# EAGLE design BBQ_Blower (EAGLE 9.4.2)
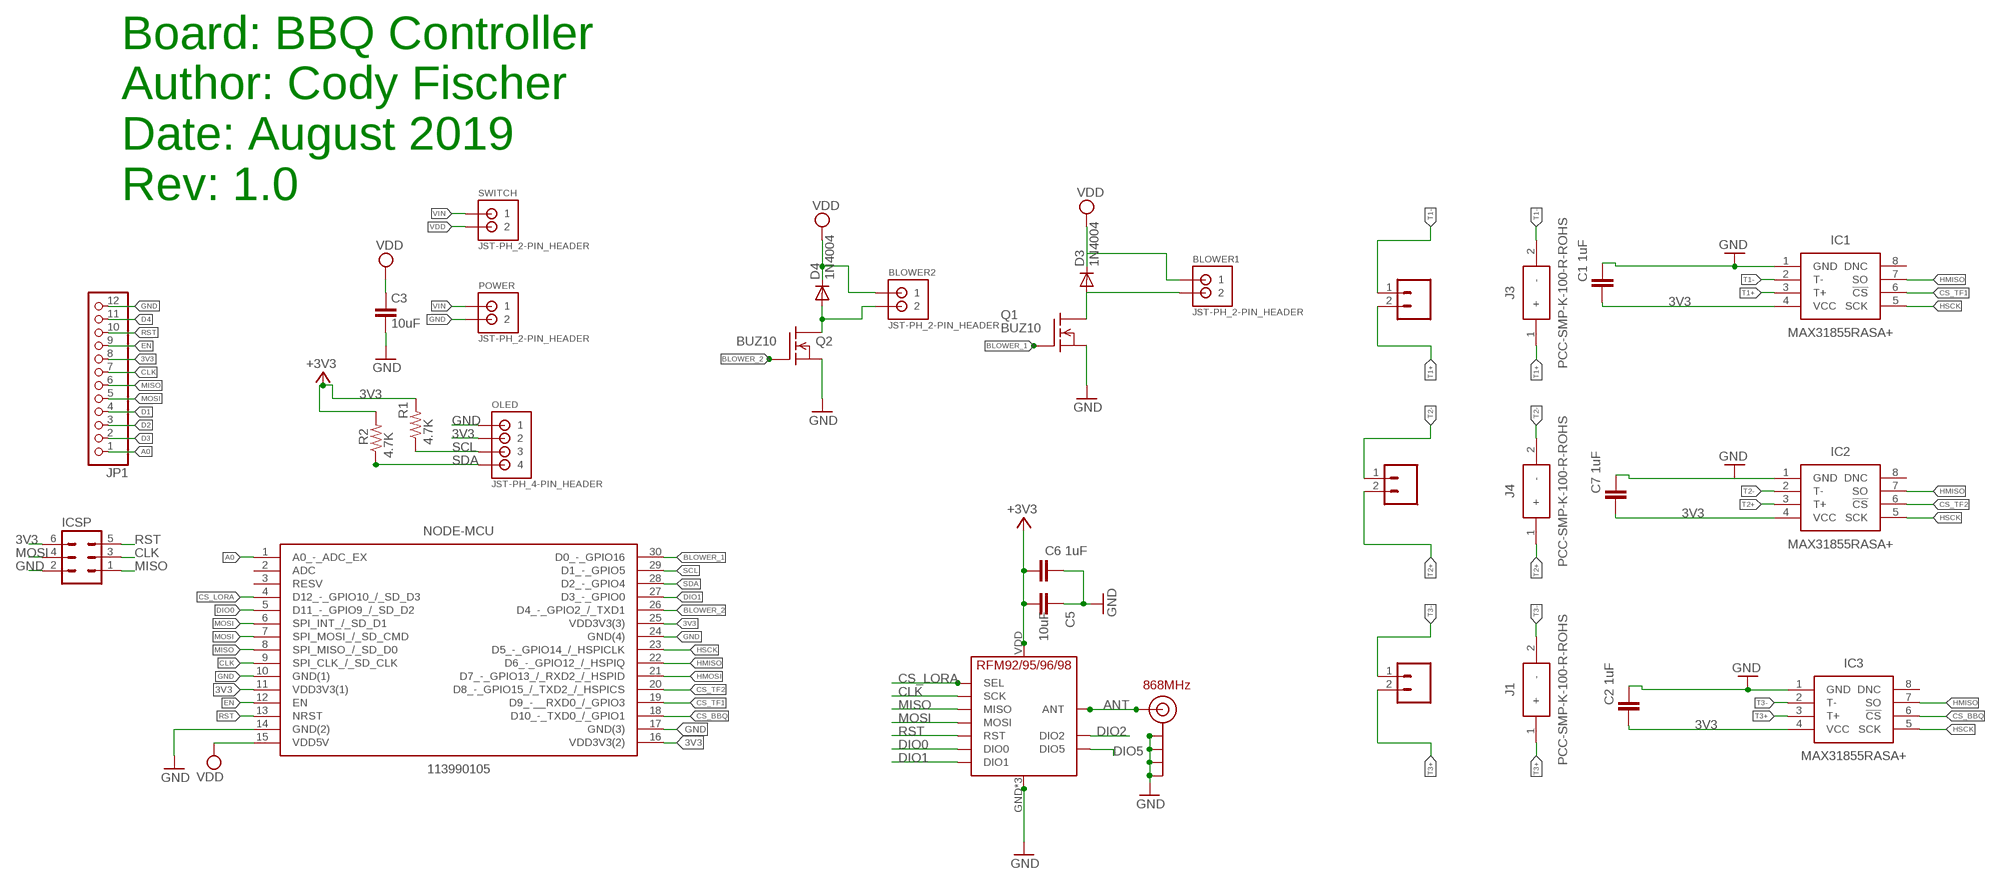
[diagram p0: schematic, sheet 1]

## Parts
BLOWER1  JST-PH_2-PIN_HEADER  [JST_B2B-PH_HEADER]
BLOWER2  JST-PH_2-PIN_HEADER  [JST_B2B-PH_HEADER]
C1  1uF  C-EUC0805K  [C0805K]
C2  1uF  C-EUC0805K  [C0805K]
C3  10uF  C-EU025-050X050  [C025-050X050]
C5  10uF  C-EUC0805K  [C0805K]
C6  1uF  C-EUC0805K  [C0805K]
C7  1uF  C-EUC0805K  [C0805K]
D3  1N4004  [DO41-10]
D4  1N4004  [DO41-10]
IC1  MAX31855RASA+  [SOIC127P600X175-8N]
IC2  MAX31855RASA+  [SOIC127P600X175-8N]
IC3  MAX31855RASA+  [SOIC127P600X175-8N]
ICSP  MA03-2  [MA03-2]
J1  PCC-SMP-K-100-R-ROHS  [PCC-SMP]
J3  PCC-SMP-K-100-R-ROHS  [PCC-SMP]
J4  PCC-SMP-K-100-R-ROHS  [PCC-SMP]
J$2  ANTENNATINY  [SMA_UFL_PAD_TINY]
JP1  PINHD-1X12  [1X12]
NODE-MCU  113990105  [DIP2286W64P254L4826H735Q30N]
OLED  JST-PH_4-PIN_HEADER  [JST_B4B-PH_HEADER]
POWER  JST-PH_2-PIN_HEADER  [JST_B2B-PH_HEADER]
Q1  BUZ10  [TO220]
Q2  BUZ10  [TO220]
R1  4.7K  RESISTOR0805-RES  [0805-RES]
R2  4.7K  RESISTOR0805-RES  [0805-RES]
SWITCH  JST-PH_2-PIN_HEADER  [JST_B2B-PH_HEADER]
TH1  CONN_025MM  [SCREWTERMINAL-5MM-2]
TH2  CONN_025MM  [SCREWTERMINAL-5MM-2]
TH3  CONN_025MM  [SCREWTERMINAL-5MM-2]
U$5  RFM95  [RFM95]

## Nets
3V3: C1.2 C2.2 C5.2 C6.2 C7.2 IC1.4(VCC) IC2.4(VCC) IC3.4(VCC) ICSP.6 JP1.8 NODE-MCU.11(VDD3V3(1)) NODE-MCU.16(VDD3V3(2)) NODE-MCU.25(VDD3V3(3)) OLED.P2 R1.2 R2.2 U$5.VDD(VCC) ; supply symbol labelled +3V3
A0: JP1.1 NODE-MCU.1(A0_-_ADC_EX)
ANT: J$2.ANT1(SIGNAL) J$2.ANT2(SIGNAL) J$2.ANT3(SIGNAL) U$5.ANT
BLOWER1: BLOWER2.P2 D4.A Q2.2(D)
BLOWER2: BLOWER1.P2 D3.A Q1.2(D)
BLOWER_1: NODE-MCU.30(D0_-_GPIO16) Q1.1(G)
BLOWER_2: NODE-MCU.26(D4_-_GPIO2_/_TXD1) Q2.1(G)
CLK: ICSP.3 JP1.7 NODE-MCU.9(SPI_CLK_/_SD_CLK) U$5.SCK
CS_BBQ: IC3.6(!CS) NODE-MCU.18(D10_-_TXD0_/_GPIO1)
CS_LORA: NODE-MCU.4(D12_-_GPIO10_/_SD_D3) U$5.NSS(SEL)
CS_TF1: IC1.6(!CS) NODE-MCU.19(D9_-__RXD0_/_GPIO3)
CS_TF2: IC2.6(!CS) NODE-MCU.20(D8_-_GPIO15_/_TXD2_/_HSPICS)
D1: JP1.4
D2: JP1.3
D3: JP1.2
D4: JP1.11
DIO0: NODE-MCU.5(D11_-_GPIO9_/_SD_D2) U$5.DIO0
DIO1: NODE-MCU.27(D3_-_GPIO0) U$5.DIO1
DIO2: U$5.DIO2
DIO5: U$5.DIO5
EN: JP1.9 NODE-MCU.12(EN)
GND: C1.1 C2.1 C3.2 C5.1 C6.1 C7.1 IC1.1(GND) IC2.1(GND) IC3.1(GND) ICSP.2 J$2.GND1(GND) J$2.GND2(GND) J$2.GND3(GND) J$2.GND4(GND) JP1.12 NODE-MCU.10(GND(1)) NODE-MCU.14(GND(2)) NODE-MCU.17(GND(3)) NODE-MCU.24(GND(4)) OLED.P1 POWER.P2 Q1.3(S) Q2.3(S) U$5.GND U$5.GND1(GND) U$5.GND2(GND)
HMISO: IC1.7(SO) IC2.7(SO) IC3.7(SO) NODE-MCU.22(D6_-_GPIO12_/_HSPIQ)
HMOSI: NODE-MCU.21(D7_-_GPIO13_/_RXD2_/_HSPID)
HSCK: IC1.5(SCK) IC2.5(SCK) IC3.5(SCK) NODE-MCU.23(D5_-_GPIO14_/_HSPICLK)
MISO: ICSP.1 JP1.6 NODE-MCU.8(SPI_MISO_/_SD_D0) U$5.MISO
MOSI: ICSP.4 JP1.5 NODE-MCU.6(SPI_INT_/_SD_D1) NODE-MCU.7(SPI_MOSI_/_SD_CMD) U$5.MOSI
RST: ICSP.5 JP1.10 NODE-MCU.13(NRST) U$5.RST
SCL: NODE-MCU.29(D1_-_GPIO5) OLED.P3 R1.1
SDA: NODE-MCU.28(D2_-_GPIO4) OLED.P4 R2.1
T1+: IC1.3(T+) J3.1(+) TH3.2
T1-: IC1.2(T-) J3.2(-) TH3.1
T2+: IC2.3(T+) J4.1(+) TH2.2
T2-: IC2.2(T-) J4.2(-) TH2.1
T3+: IC3.3(T+) J1.1(+) TH1.2
T3-: IC3.2(T-) J1.2(-) TH1.1
VDD: BLOWER1.P1 BLOWER2.P1 C3.1 D3.C D4.C NODE-MCU.15(VDD5V) SWITCH.P2
VIN: POWER.P1 SWITCH.P1
Unconnected: IC1.8(DNC) IC2.8(DNC) IC3.8(DNC) NODE-MCU.2(ADC) NODE-MCU.3(RESV)

## Notes on the sheet
- Board: BBQ Controller
  Author: Cody Fischer
  Date: August 2019
  Rev: 1.0
- 868MHz

## Library data of the parts
BLOWER1 BLOWER2 POWER SWITCH = SRG:JST-PH_2-PIN_HEADER: 2-pin JST PH Shrouded Header, top entry P/N B2B-PH-K-S Mating connector PHR-2 Mating cable assembly: Sparkfun PRT-09914 <http://www.sparkfun.com/products/9914>
C1-C3 C5-C7 = resistor:C-EU: CAPACITOR, European symbol
D3 D4 = adafruit:1N4004: DIODE General purpose 1N400x type rectifier (With bigger pads) http://www.ladyada.net/library/pcb/eaglelibrary.html
IC1-IC3 = MAX31855RASA+:MAX31855RASA+: Thermocouple-to-Digital, type R SOIC8 Maxim MAX31855RASA+, Thermocouple Amplifier, 3.3 V, 8-Pin SOIC <https://componentsearchengine.com/Images/3/MAX31855RASA%2B.jpg> Source: Datasheet <https://datasheets.maximintegrated.com/en/ds/MAX31855.pdf>; DESCRIPTION: Thermocouple-to-Digital, type R SOIC8 Maxim MAX31855RASA+, Thermocouple Amplifier, 3.3 V, 8-Pin SOIC; HEIGHT: 1.75mm; MANUFACTURER_NAME: Maxim Integrated; MANUFACTURER_PART_NUMBER: MAX31855RASA+; RS_PART_NUMBER: 7833891P; SUPPLIER_NAME: RS
ICSP = con-lstb:MA03-2: PIN HEADER; OC_FARNELL: unknown; OC_NEWARK: unknown
J1 J3 J4 = PCC-SMP-K-100-R-ROHS:PCC-SMP-K-100-R-ROHS: NEWPORT ELECTRONICS - PCC-SMP-K-100-R-ROHS - CIRCUIT BOARD THERMOCOUPLE, K TYPE Source: Datasheet <http://www.farnell.com/datasheets/1789660.pdf>; DESCRIPTION: NEWPORT ELECTRONICS - PCC-SMP-K-100-R-ROHS - CIRCUIT BOARD THERMOCOUPLE, K TYPE; HEIGHT: mm; MANUFACTURER_NAME: NEWPORT ELECTRONICS; MANUFACTURER_PART_NUMBER: PCC-SMP-K-100-R-ROHS; SUPPLIER_NAME: RS
J$2 = _c2h:ANTENNA: SMA Antenna Connector End launch SMA connector. The paste layer has been removed so that the connector can be hand soldered onto the board after reflow.
JP1 = adafruit:PINHD-1X12: PIN HEADER
NODE-MCU = 113990105:113990105: NodeMCU DEVKIT V1.0 <https://componentsearchengine.com/Images/1/113990105.jpg> Source: Datasheet <https://github.com/nodemcu/nodemcu-devkit-v1.0/blob/master/NODEMCU_DEVKIT_V1.0.PDF>; DESCRIPTION: NodeMCU DEVKIT V1.0; HEIGHT: 7.35mm; MANUFACTURER_NAME: Seeed Studio; MANUFACTURER_PART_NUMBER: 113990105; SUPPLIER_NAME: RS
OLED = SRG:JST-PH_4-PIN_HEADER: 4-pin JST PH Shrouded Header, top entry P/N B4B-PH-K-S Mating connector PHR-4 Mating cable assembly: Sparkfun PRT-09916 <http://www.sparkfun.com/products/9916>
Q1 Q2 = transistor-fet:BUZ10: N-Channel Enhancement MOSFET 50V; 20A; 0,080Ohm
R1 R2 = _c2h:RESISTOR: Resistor Basic schematic elements and footprints for 0603, 1206, and PTH resistors.
TH1-TH3 = SparkFun-Connectors:CONN_02: Multi connection point. Often used as Generic Header-pin footprint for 0.1 inch spaced/style header connections On any of the 0.1 inch spaced packages, you can populate with these: Break Away Headers - Straight <https://www.sparkfun.com/products/116> (PRT-00116) Break Away Male Headers - Right Angle <https://www.sparkfun.com/products/553> (PRT-00553) Female Headers <https://www.sparkfun.com/products/115> (PRT-00115) Break Away Headers - Machine Pin <https://www.sparkfun.com/products/117> (PRT-00117) Break Away Female Headers - Swiss Machine Pin <https://www.sparkfun.com/products/743> (PRT-00743) For SCREWTERMINALS and SPRING TERMINALS visit here: Screw Terimnals on SparkFun.com <https://www.sparkfun.com/search/results?term=Screw+Terminals> (5mm/3.5mm/2.54mm spacing) This device is also useful as a general connection point to wire up your design to another part of your project. Our various solder wires solder well into these plated through hole pads. Hook-Up Wire - Assortment (Stranded, 22 AWG) <https://www.sparkfun.com/products/11375> (PRT-11375) Hook-Up Wire - Assortment (Solid Core, 22 AWG) <https://www.sparkfun.com/products/11367> (PRT-11367) View the entire wire category on our website here <https://www.sparkfun.com/categories/141> Special notes: Molex polarized connector foot print use with: PRT-08233 with associated crimp pins and housings. 2.54_SCREWTERM for use with PRT-10571. 3.5mm Screw Terminal footprints for PRT-08084 5mm Screw Terminal footprints for use with PRT-08432; SF_SKU: PRT-08432
U$5 = _c2h:RFM95

## Net classes
0 default: width 0.203 mm, drill 0.356 mm, clearance 0.152 mm
1 POWER: width 1.905 mm, clearance 0.381 mm

## Board
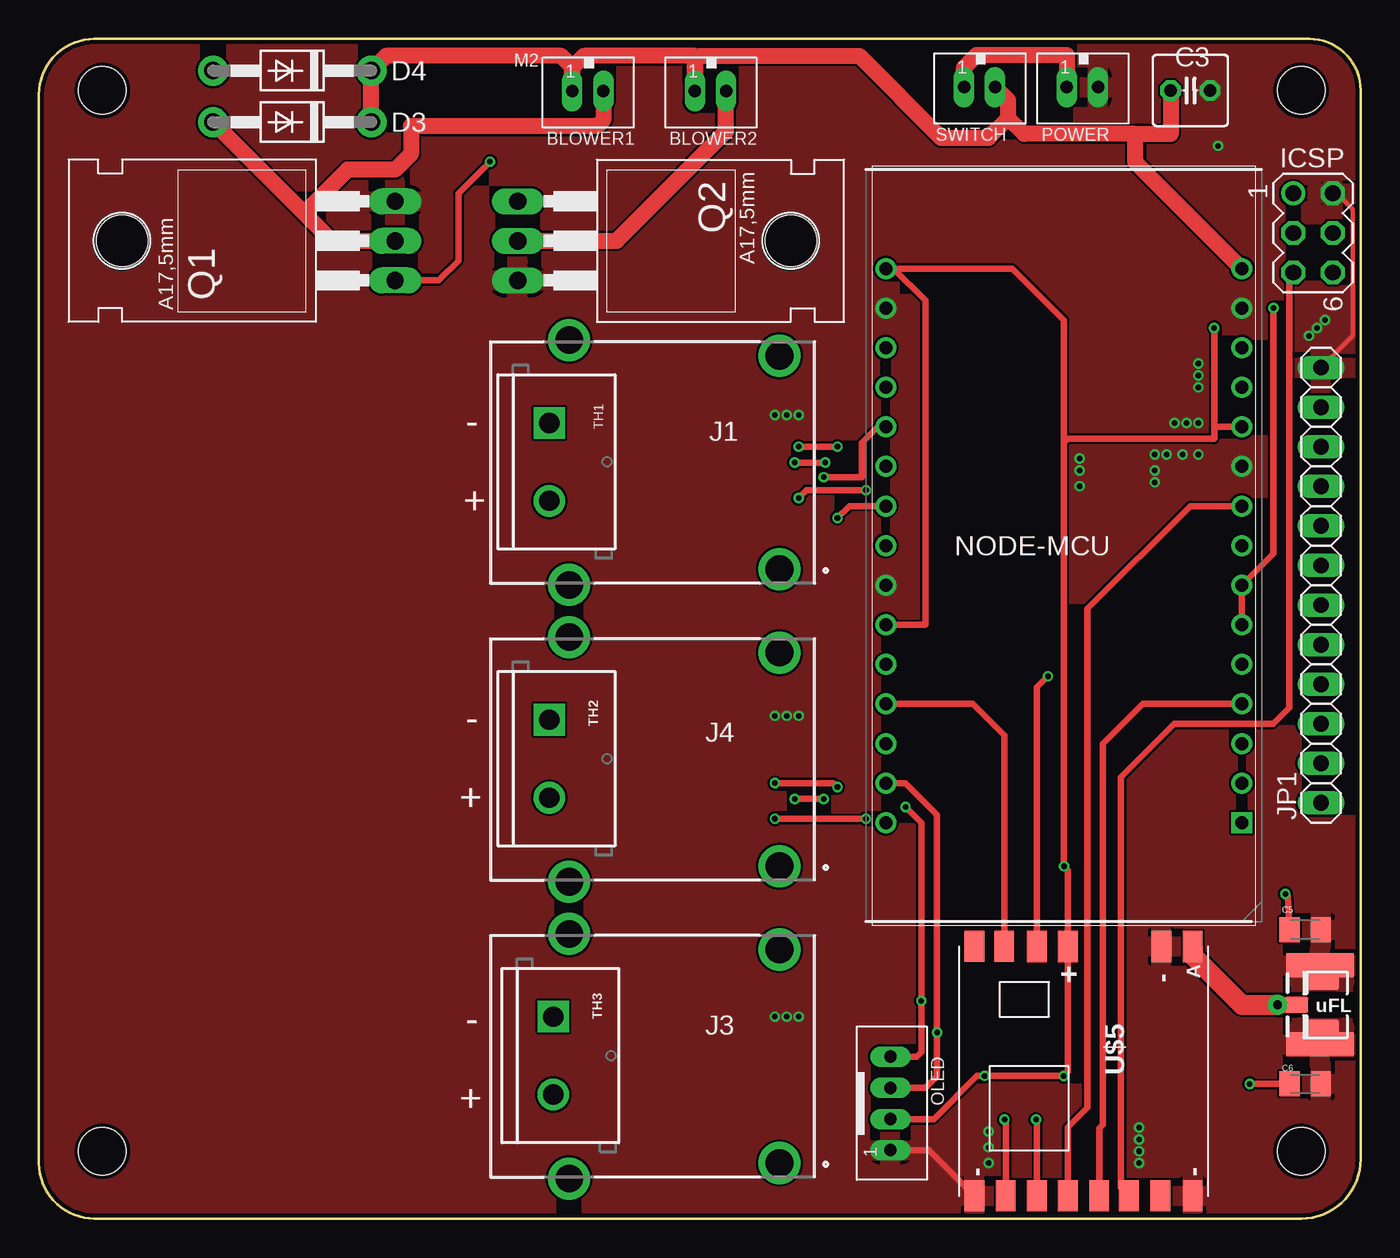
[diagram p1: board, top side]
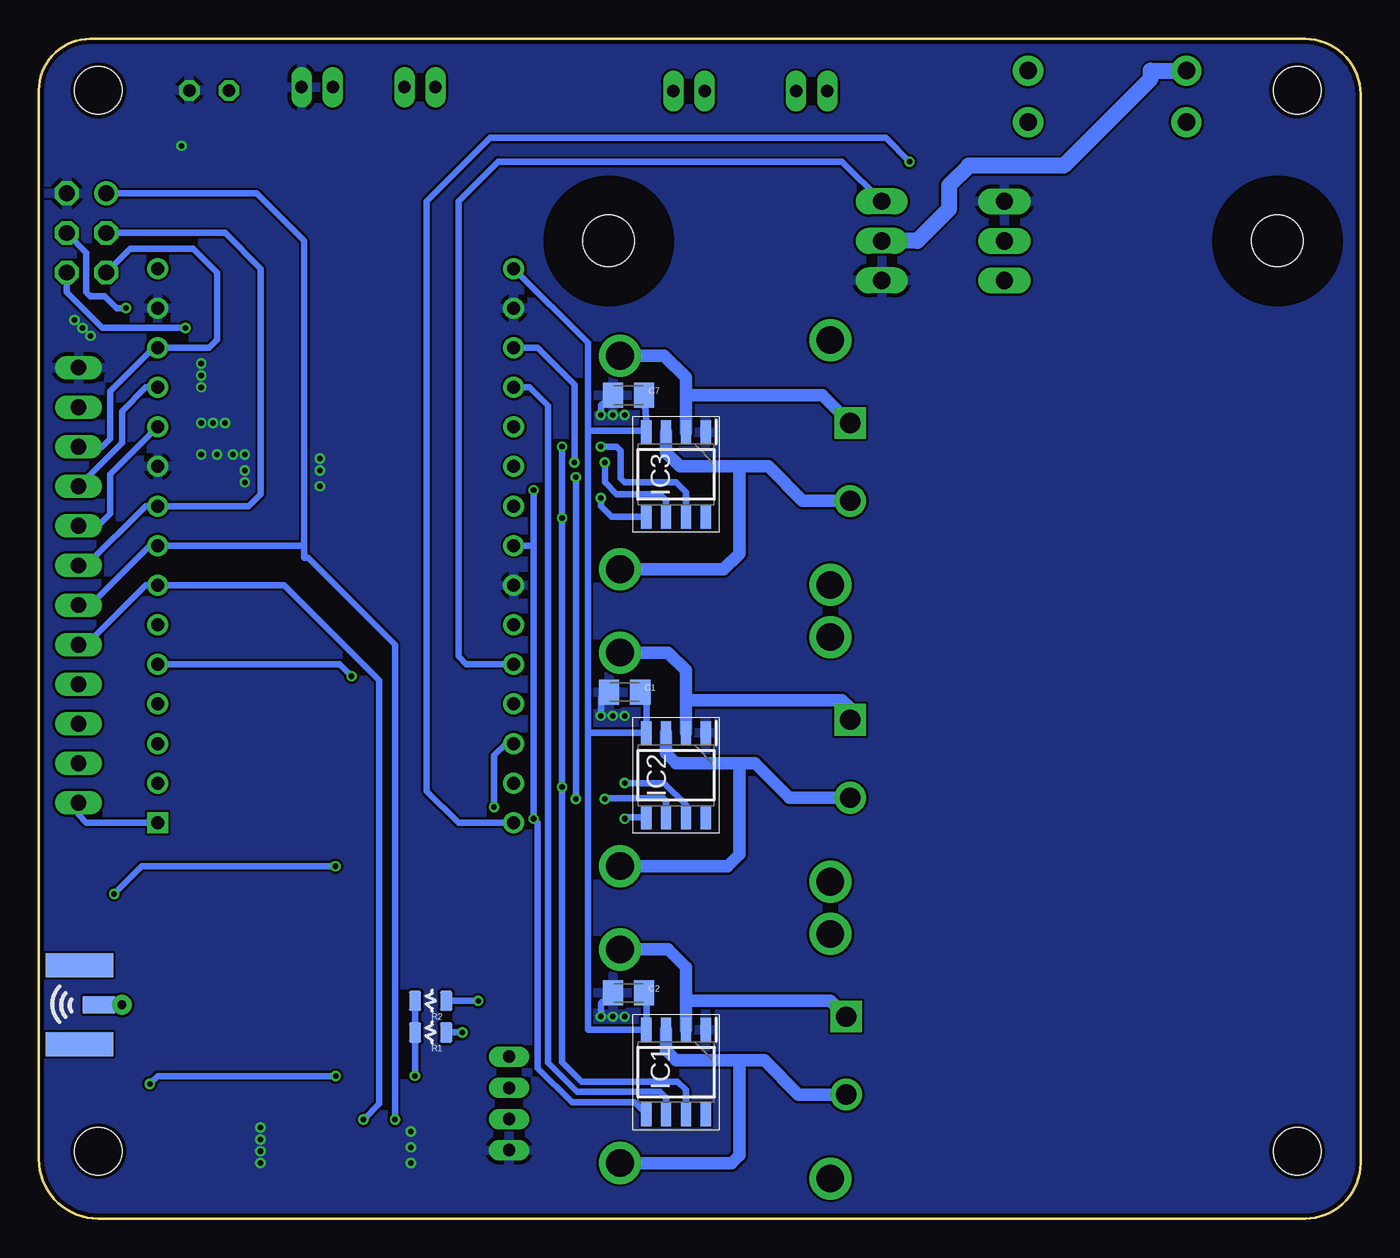
[diagram p2: board, bottom side, seen from below]

Size 84.84 x 75.69 mm. Coordinates in mm from the lower left corner, seen from the top.
Outline: 3.56,0 81.03,0 arc90 84.84,3.81 84.84,72.39 arc90 81.53,75.69 3.56,75.69 arc90 0,72.14 0,3.56 arc90 3.56,0
Copper layers (1*16): Top 0.035mm / dielectric 1.5mm / Bottom 0.035mm
Design rules "seeed-studio-2-layer": minimum track width 6mil, minimum drill 12mil, track to track 6mil, track to pad 6mil, pad to pad 6mil, via to via 6mil, smd to smd 0mil, copper to edge 10mil, drill to drill 10mil, minimum pad ring 10mil, minimum via ring 6mil, stop-mask expansion 2mil, vias tented up to drill 100mil, thermal gap 10mil
Holes 3.05 mm at 4.06,72.39 4.06,4.32 81.03,4.32 81.03,72.39

### Footprints (pad centres in the part's own frame; a part is rotated, then mirrored left to right if it is on the bottom)
JST_B2B-PH_HEADER = drill 0.8 long: P1 1.075,0.048; P2 -0.925,0.048
C0805K = smd 1.3 x 1.6: 1 -1,0; 2 1,0
C025-050X050 = drill 0.813 octagon: 1 -1.27,0; 2 1.27,0
DO41-10 = drill 1.118 pad 1.93: A 5.08,0; C -5.08,0
SOIC127P600X175-8N = smd 1.525 x 0.65: 1 -2.712,1.905; 2 -2.712,0.635; 3 -2.712,-0.635; 4 -2.712,-1.905; 5 2.712,-1.905; 6 2.712,-0.635; 7 2.712,0.635; 8 2.712,1.905
MA03-2 = drill 1.016: 1 -2.54,-1.27 | drill 1.016 octagon: 2 -2.54,1.27; 3 0,-1.27; 4 0,1.27; 5 2.54,-1.27; 6 2.54,1.27
PCC-SMP = drill 1.77 pad 2.7: 1 2.25,6.85; 2 2.25,-6.85; 3 15.75,7.85; 4 15.75,-7.85
SMA_UFL_PAD_TINY = smd 1.524 x 1.016: ANT1 -3.843,0 | drill 0.559 pad 1.27: ANT2 -5.08,0 | smd 2.032 x 1.143 bottom: ANT3 -3.589,0 | smd 2.2 x 1.016: GND1 -2.223,1.47; GND2 -2.223,-1.47 | smd 4.318 x 1.524: GND3 -2.349,-2.54; GND4 -2.349,2.54 | smd 4.318 x 1.524 bottom: GND5 -2.349,2.54; GND6 -2.349,-2.54
1X12 = drill 1.016 long: 1 -13.97,0; 2 -11.43,0; 3 -8.89,0; 4 -6.35,0; 5 -3.81,0; 6 -1.27,0; 7 1.27,0; 8 3.81,0; 9 6.35,0; 10 8.89,0; 11 11.43,0; 12 13.97,0
DIP2286W64P254L4826H735Q30N = drill 0.835 pad 1.235 square: 1 -11.43,17.78 | drill 0.835 pad 1.235: 2 -11.43,15.24; 3 -11.43,12.7; 4 -11.43,10.16; 5 -11.43,7.62; 6 -11.43,5.08; 7 -11.43,2.54; 8 -11.43,0; 9 -11.43,-2.54; 10 -11.43,-5.08; 11 -11.43,-7.62; 12 -11.43,-10.16; 13 -11.43,-12.7; 14 -11.43,-15.24; 15 -11.43,-17.78; 16 11.43,-17.78; 17 11.43,-15.24; 18 11.43,-12.7; 19 11.43,-10.16; 20 11.43,-7.62; 21 11.43,-5.08; 22 11.43,-2.54; 23 11.43,0; 24 11.43,2.54; 25 11.43,5.08; 26 11.43,7.62; 27 11.43,10.16; 28 11.43,12.7; 29 11.43,15.24; 30 11.43,17.78
JST_B4B-PH_HEADER = drill 0.8 long: P1 2.98,0.048; P2 0.98,0.048; P3 -1.02,0.048; P4 -3.02,0.048
TO220 = drill 1.118 long: 1 -2.54,-6.35; 2 0,-6.35; 3 2.54,-6.35 | hole 3.302: 0,11.176
0805-RES = smd 0.8 x 1.3: 1 -1,0; 2 1,0
SCREWTERMINAL-5MM-2 = drill 1.3 pad 2.032 square: 1 0,0 | drill 1.3 pad 2.032: 2 5,0
RFM95 = smd 2 x 1.27: ANT 5.777,-7; DIO0 5.777,3; DIO1 5.779,5.095; DIO2 5.779,7; DIO5 -10.225,-4.936; GND 5.777,-5; GND1 -10.223,7; GND2 -10.23,-7; MISO -10.23,5; MOSI -10.225,3; NSS -10.223,-1; RST -10.223,-2.905; SCK -10.23,1.012; VDD 5.777,1

### Placement (x,y rotation side)
BLOWER1  35.31,72.39 180 top
BLOWER2  43.18,72.39 180 top
C1  47.24,33.78 0 bottom
C2  46.99,14.48 0 bottom
C3  73.91,72.39 0 top
C5  81.28,18.54 180 top
C6  81.28,8.64 180 top
C7  46.99,52.83 0 bottom
D3  16.26,70.36 180 top
D4  16.26,73.66 180 top
IC1  43.94,9.4 270 bottom
IC2  43.94,28.45 270 bottom
IC3  43.94,47.75 270 bottom
ICSP  81.79,63.25 270 top
J1  49.78,48.51 180 top
J3  49.78,10.41 180 top
J4  49.78,29.46 180 top
J$2  84.58,13.72 0 top
JP1  82.3,40.64 90 top
NODE-MCU  65.79,43.18 180 top
OLED  54.61,7.37 270 top
POWER  67.06,72.64 180 top
Q1  16.51,62.74 90 top
Q2  37.08,62.74 270 top
R1  59.69,11.94 180 bottom
R2  59.69,13.97 180 bottom
SWITCH  60.45,72.64 180 top
TH1  32.77,51.05 270 top
TH2  32.77,32 270 top
TH3  33.02,12.95 270 top
U$5  67.06,11.68 90 top

### Tracks (layer width: path | path; a pad name or v marks a point on that pad's centre or on a via)
3V3  (via drill 0.36)
  Top 0.406: NODE-MCU.25 56.9,38.1 56.9,58.93 54.86,60.96 NODE-MCU.16 62.48,60.96 65.8,57.64 65.8,49.78 | 65.8,49.78 v65.8,22.61 66.06,22.35 U$5.VDD 66.06,9.41 65.8,9.16 | v80.01,20.83 80.15,20.68 C5.2 | 65.8,9.16 v65.79,9.14 | v77.72,8.64 C6.2 | NODE-MCU.11 75.44,50.8 | 65.8,49.78 66.06,50.04 75.44,50.04 75.44,50.8 | v75.44,57.15 75.44,50.8 | OLED.P2 57.44,6.39 60.21,9.16 v60.71,9.16 65.8,9.16
  Bottom 0.406: IC3.4 45.83,50.48 45.83,50.8 | 45.83,50.8 45.83,51.05 C7.2 | C2.2 45.85,14.46 IC1.4 49.58,12.11 49.58,31.24 | C1.2 45.85,33.51 IC2.4 49.5,31.16 49.58,31.24 | 49.58,50.55 46.08,50.55 45.83,50.8 | v65.8,22.61 78.23,22.61 v80.01,20.83 | v65.79,9.14 77.22,9.14 v77.72,8.64 | NODE-MCU.16 49.58,56.19 49.58,50.55 | 49.58,31.24 49.58,50.55 | JP1.8 81.03,44.45 80.26,45.21 80.26,47.75 NODE-MCU.11 | v75.44,57.15 80.77,57.15 83.06,59.44 ICSP.6 | R2.2 R1.2 60.69,9.16 60.71,9.14 v60.71,9.16
A0
  Bottom 0.406: NODE-MCU.1 81.79,25.4 82.3,25.91 JP1.1
ANT
  Top 1.016: J$2.ANT2 J$2.ANT1
  Top 1.27: U$5.ANT 74.06,16.88 77.22,13.72 J$2.ANT2
  Bottom 1.016: J$2.ANT2 J$2.ANT3
BLOWER1
  Top 1.016: Q2.2 37.08,62.74 44.11,69.76 BLOWER2.P2
  Bottom 1.016: D4.A 13.46,73.66 13.46,73.15 19.05,67.56 25.15,67.56 26.42,66.29 26.42,64.77 28.45,62.74 Q2.2
BLOWER2
  Top 1.016: D3.A 17.02,64.52 | 17.02,64.52 18.8,62.74 Q1.2 | 17.02,64.52 19.81,67.31 22.86,67.31 23.88,68.33 23.88,70.1 35.81,70.1 36.23,70.52 BLOWER1.P2
BLOWER_1  (via drill 0.36)
  Top 0.406: v28.96,67.82 26.92,65.79 26.92,61.47 25.65,60.2 Q1.1
  Bottom 0.406: NODE-MCU.30 57.91,25.4 59.94,27.43 59.94,65.28 55.88,69.34 30.48,69.34 v28.96,67.82
BLOWER_2
  Bottom 0.406: Q2.1 33.27,67.82 55.37,67.82 57.91,65.28 57.91,36.07 57.4,35.56 NODE-MCU.26
CLK
  Top 0.406: U$5.SCK 66.04,5.85 67.31,7.11 67.31,39.12 73.91,45.72 NODE-MCU.9
  Bottom 0.406: JP1.7 81.79,41.91 77.98,45.72 NODE-MCU.9 71.37,45.72 70.61,46.48 70.61,60.96 72.9,63.25 ICSP.3
CS_BBQ  (via drill 0.36)
  Top 0.406: v50.47,48.51 v48.51,48.51
  Bottom 0.406: IC3.6 44.58,46.1 44.96,46.48 47.75,46.48 48.51,47.24 v48.51,48.51 | v50.47,48.51 50.47,53.52 52.83,55.88 NODE-MCU.18
CS_LORA
  Top 0.406: U$5.NSS 68.06,5.78 68.31,6.03 68.31,30.46 70.87,33.02 NODE-MCU.4
CS_TF1
  Bottom 0.406: NODE-MCU.19 53.34,53.34 52.17,52.17 52.17,10.01 50.29,8.13 44.96,8.13 44.58,7.75 IC1.6
CS_TF2  (via drill 0.36)
  Top 0.406: v48.51,26.92 v50.37,26.92 | v50.37,47.57 52.83,47.57 52.83,49.78 53.85,50.8 NODE-MCU.20
  Bottom 0.406: IC2.6 44.58,26.8 44.74,26.96 48.48,26.96 v48.51,26.92 | v50.37,26.92 v50.37,47.57
DIO0  (via drill 0.36)
  Top 0.406: v64.77,34.8 64.06,34.08 U$5.DIO0
  Bottom 0.406: v64.77,34.8 65.53,35.56 NODE-MCU.5
DIO1
  Top 0.406: U$5.DIO1 61.96,31 59.94,33.02 NODE-MCU.27
EN
  Bottom 0.406: JP1.9 79.5,49.78 79.5,51.82 77.98,53.34 NODE-MCU.12
GND  (via drill 0.36)
  Top 0.305: ICSP.2 83.31,65.79 84.33,64.77 84.33,56.64 JP1.12
  Top 0.406: J$2.GND4 82.36,16.13 J$2.GND1 | J$2.GND3 82.23,12.12 J$2.GND2 | OLED.P1 57.13,4.39 U$5.GND1
  Bottom 0.406: C1.1 48.77,33.38 v48.77,32.26 | C2.1 48.77,13.83 v48.77,12.95 | C7.1 48.77,52.18 v48.77,51.56
  other vias: 48.01,32.26 47.24,32.26 48.01,12.95 47.24,12.95 48.01,51.56 47.24,51.56 74.42,49.02 73.41,49.02 72.39,49.02 71.63,49.02 71.63,48.01 71.63,47.24 66.8,46.99 66.8,48.01 66.8,48.77 70.61,3.56 70.61,4.32 70.61,5.08 70.61,5.84 60.96,3.56 60.96,4.57 60.96,5.59 81.53,56.64 82.04,57.15 82.55,57.66 74.42,54.86 74.42,54.1 74.42,53.34 74.42,51.05 73.66,51.05 72.9,51.05 75.69,68.83
  pour Bottom: -3.81,-2.79 89.15,-2.79 89.15,79.5 -3.56,79.5 -4.06,78.99 -4.06,-2.54
  pour Top: -3.56,79.5 88.9,79.5 89.15,79.25 89.15,-2.29 89.41,-2.54 -3.81,-2.54 -4.32,-3.05 -4.32,78.99 -3.81,79.5 -3.81,78.99
HMISO  (via drill 0.36)
  Top 0.406: v51.26,27.69 51,27.94 v47.24,27.94 | v51.26,49.53 v48.77,49.53 | NODE-MCU.22 52.02,45.72 v51.26,44.96
  Bottom 0.406: v51.26,49.53 v51.26,44.96 v51.26,27.69 51.26,10.03 50.02,8.79 43.84,8.79 43.31,8.26 IC1.7 | v47.24,27.94 44.7,27.94 43.31,26.54 IC2.7 | v48.77,49.53 47.75,49.53 47.5,49.28 47.5,47.5 47.24,47.24 43.94,47.24 43.31,46.61 IC3.7
HSCK  (via drill 0.36)
  Top 0.406: v47.24,25.65 v53.09,25.65 | v53.09,46.74 49.28,46.74 v48.77,46.23
  Bottom 0.406: 53.09,43.18 v53.09,25.65 52.83,25.4 52.83,9.65 50.63,7.45 46.61,7.45 IC1.5 | 53.09,43.18 v53.09,46.74 | IC2.5 47.16,25.74 v47.24,25.65 | v48.77,46.23 48.77,45.72 48.09,45.04 IC3.5 | NODE-MCU.23 53.09,43.18
MISO  (via drill 0.36)
  Top 0.406: v61.98,6.35 62.06,6.27 U$5.MISO
  Bottom 0.406: v61.98,6.35 61.98,36.83 67.56,42.42 67.82,42.42 67.82,43.18 | 67.82,43.18 NODE-MCU.8 77.72,43.18 81.53,39.37 JP1.6 | ICSP.1 70.87,65.79 67.82,62.74 67.82,43.18
MOSI  (via drill 0.36)
  Top 0.406: v64.01,6.35 64.06,6.3 U$5.MOSI | v79.25,58.42 79.25,42.67 NODE-MCU.7 NODE-MCU.6
  Bottom 0.406: v64.01,6.35 62.99,7.37 62.99,34.54 69.09,40.64 NODE-MCU.7 77.98,40.64 81.79,36.83 JP1.5 | v79.25,58.42 79.84,58.42 80.6,59.18 81.53,59.18 81.79,59.44 81.79,61.98 ICSP.4
RST
  Top 0.406: U$5.RST 69.45,1.97 69.45,28.3 72.9,31.75 79.25,31.75 80.26,32.77 80.26,60.45 ICSP.5
  Bottom 0.406: ICSP.5 78.99,62.23 74.93,62.23 73.41,60.71 73.41,56.39 73.91,55.88 NODE-MCU.13 77.47,55.88 80.26,53.09 80.26,50.04 80.77,49.53 JP1.10
SCL  (via drill 0.36)
  Top 0.406: NODE-MCU.29 55.63,27.94 57.66,25.91 v57.66,11.94 57.66,9.14 56.9,8.39 OLED.P3
  Bottom 0.406: R1.1 v57.66,11.94
SDA  (via drill 0.36)
  Top 0.406: OLED.P4 56.36,10.39 56.64,10.67 v56.64,13.97 56.64,25.4 v55.63,26.42
  Bottom 0.406: v55.63,26.42 55.63,29.72 54.86,30.48 NODE-MCU.28 | R2.1 v56.64,13.97
T1+
  Bottom 0.813: IC1.3 44.58,10.79 43.94,10.16 39.88,10.16 | TH3.2 36.07,7.95 38.27,10.16 39.88,10.16 | J3.1 40.39,3.56 39.88,4.06 39.88,10.16
T1-
  Bottom 0.813: IC1.2 43.31,13.97 | 43.31,13.97 43.31,16.13 44.45,17.27 J3.2 | TH3.1 34.04,13.97 43.31,13.97
T2+
  Bottom 0.813: IC2.3 44.58,29.84 43.94,29.21 39.88,29.21 | 39.88,29.21 38.86,29.21 36.66,27 TH2.2 | J4.1 40.63,22.61 39.88,23.37 39.88,29.21
T2-
  Bottom 0.813: IC2.2 43.31,33.27 | 43.31,33.27 43.31,35.18 44.45,36.32 J4.2 | TH2.1 32.77,32.77 33.27,33.27 43.31,33.27
T3+
  Bottom 0.813: IC3.3 44.58,49.15 43.69,48.26 39.88,48.26 | TH1.2 35.81,46.05 38.02,48.26 39.88,48.26 | J1.1 40.89,41.66 39.88,42.67 39.88,48.26
T3-
  Bottom 0.813: IC3.2 43.31,52.83 | 43.31,52.83 43.31,53.98 44.7,55.37 J1.2 | TH1.1 34.54,52.83 43.31,52.83
VDD
  Top 1.016: D3.C D4.C 22.28,74.6 33.53,74.6 34.23,73.9 BLOWER1.P1 34.23,73.85 34.98,74.6 42.11,74.6 BLOWER2.P1 42.11,74.29 42.42,74.6 52.65,74.6 57.91,69.34 60.96,69.34 62.23,70.61 | NODE-MCU.15 70.36,67.82 70.36,69.6 | C3.1 72.64,69.6 70.36,69.6 | SWITCH.P2 62.23,71.74 62.23,70.61 | 70.36,69.6 63.25,69.6 62.23,70.61
VIN
  Top 1.016: SWITCH.P1 59.38,73.85 60.2,74.68 65.98,74.68 POWER.P1

### Text on the board
tPlace: M2 | - | + | - | + | - | +
tStop: BBQ Temp | Board: BBQ Controller / Author: Cody Fischer / Date: August 2019 / Rev: 1.0 | Food Temp 2 | Food Temp 1